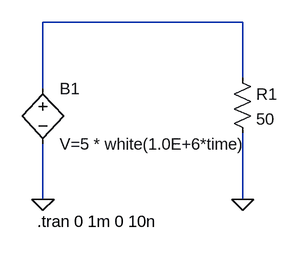
[diagram p0: schematic 1.asc]
1.asc, the LTspice schematic file:
Version 4
SHEET 1 880 680
WIRE 368 32 80 32
WIRE 368 112 368 32
WIRE 80 128 80 32
WIRE 80 288 80 208
WIRE 368 288 368 192
FLAG 80 288 0
FLAG 368 288 0
SYMBOL bv 80 112 R0
SYMATTR InstName B1
SYMATTR Value V=5 * white(1.0E+6*time)
SYMBOL res 352 96 R0
SYMATTR InstName R1
SYMATTR Value 50
TEXT 72 320 Left 2 !.tran 0 1m 0 10n

The netlist it stands for:
* 1.asc
B1 N001 0 V=5 * white(1.0E+6*time)
R1 N001 0 50
.tran 0 1m 0 10n
.backanno
.end